# EAGLE design us_supply (EAGLE 4.11)
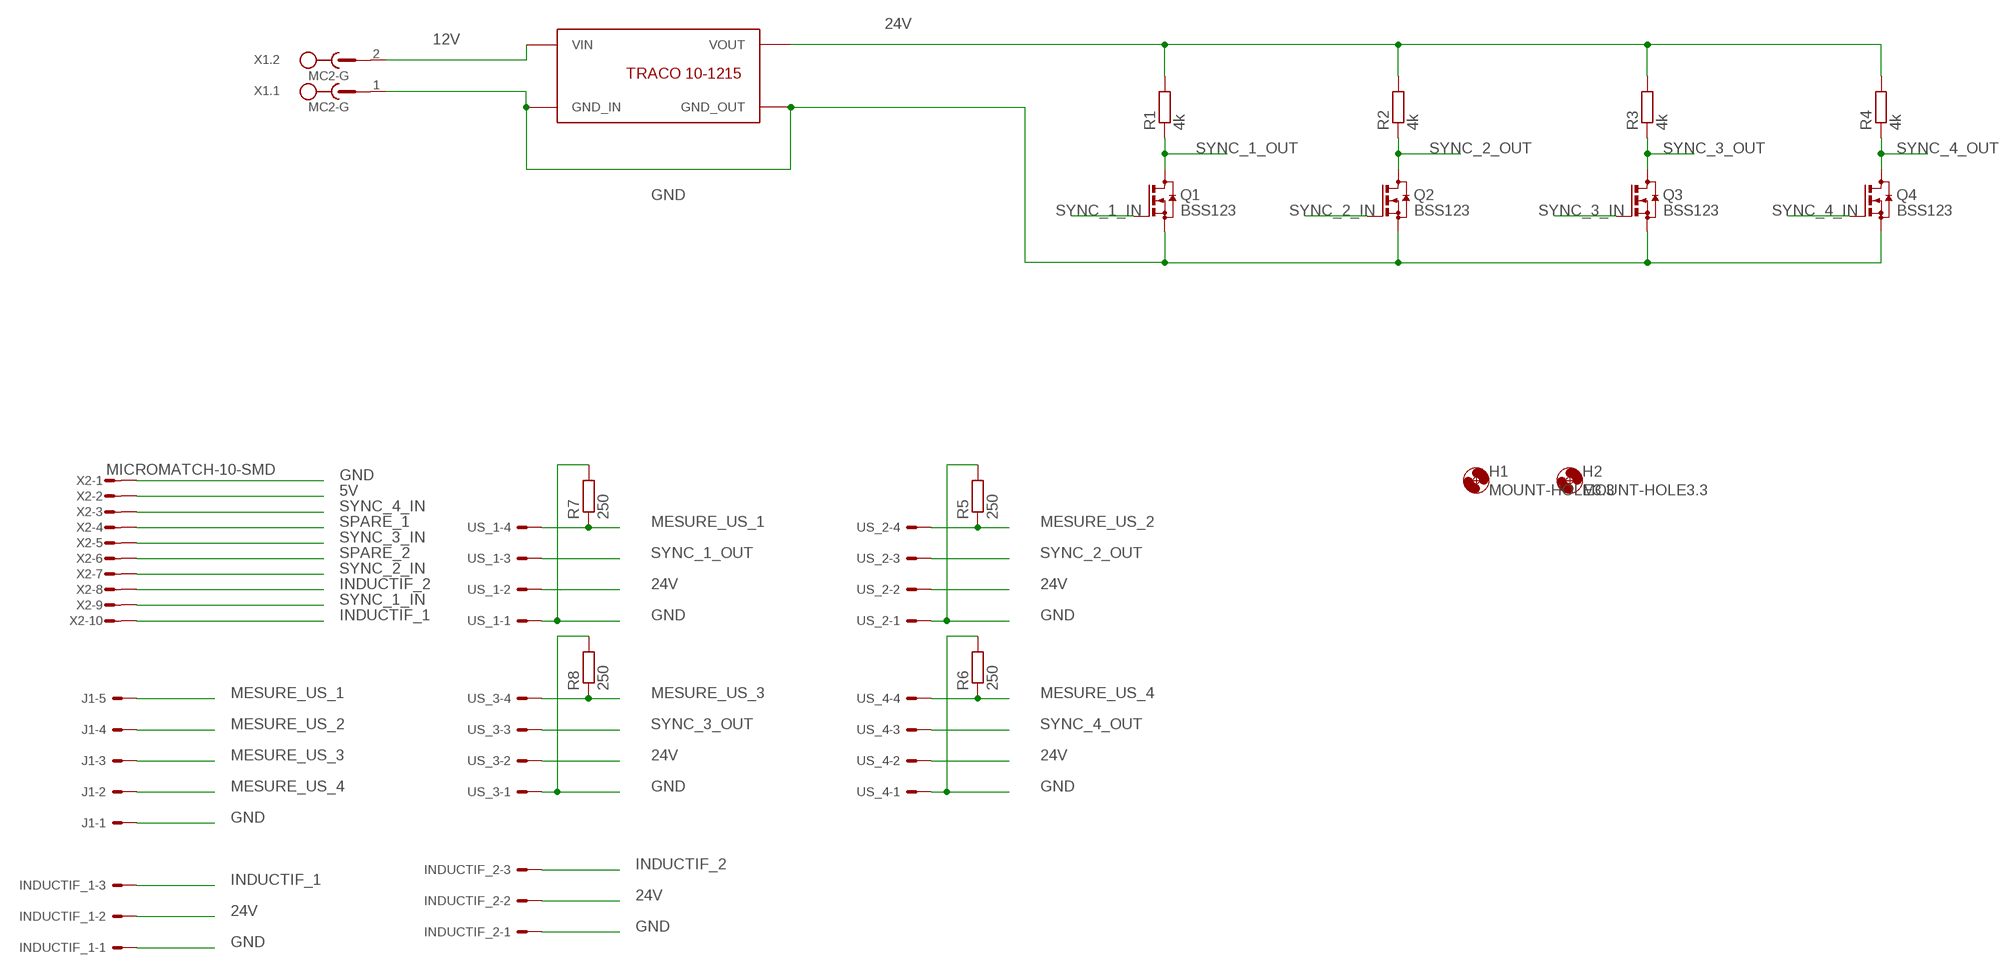
[diagram p0: schematic, sheet 1]

## Parts
H1  MOUNT-HOLE3.3  [3,3]
H2  MOUNT-HOLE3.3  [3,3]
INDUCTIF_1  ED1X03  [ED1X03]
INDUCTIF_2  ED1X03  [ED1X03]
J1  ED1X05  [ED1X05]
Q1  BSS123  [SOT23]
Q2  BSS123  [SOT23]
Q3  BSS123  [SOT23]
Q4  BSS123  [SOT23]
R1  4k  R-EU_R0805  [R0805]
R2  4k  R-EU_R0805  [R0805]
R3  4k  R-EU_R0805  [R0805]
R4  4k  R-EU_R0805  [R0805]
R5  250  R-EU_R0805  [R0805]
R6  250  R-EU_R0805  [R0805]
R7  250  R-EU_R0805  [R0805]
R8  250  R-EU_R0805  [R0805]
U$1  TRACO_TEN-10-1215  [TRACO_TEN-10-1215]
US_1  ED1X04  [ED1X04]
US_2  ED1X04  [ED1X04]
US_3  ED1X04  [ED1X04]
US_4  ED1X04  [ED1X04]
X1  MC2-G  [MC2-G]
X2  MICROMATCH-10-SMD  [MICROMATCH-10-SMD]

## Nets
5V: X2.2
12V: U$1.1(VIN) X1.2
24V: INDUCTIF_1.2 INDUCTIF_2.2 R1.2 R2.2 R3.2 R4.2 U$1.3(VOUT) US_1.2 US_2.2 US_3.2 US_4.2
GND: INDUCTIF_1.1 INDUCTIF_2.1 J1.1 Q1.2(S) Q2.2(S) Q3.2(S) Q4.2(S) R5.2 R6.2 R7.2 R8.2 U$1.2(GND_IN) U$1.5(GND_OUT) US_1.1 US_2.1 US_3.1 US_4.1 X1.1 X2.1
INDUCTIF_1: INDUCTIF_1.3 X2.10
INDUCTIF_2: INDUCTIF_2.3 X2.8
MESURE_US_1: J1.5 R7.1 US_1.4
MESURE_US_2: J1.4 R5.1 US_2.4
MESURE_US_3: J1.3 R8.1 US_3.4
MESURE_US_4: J1.2 R6.1 US_4.4
SPARE_1: X2.4
SPARE_2: X2.6
SYNC_1_IN: Q1.1(G) X2.9
SYNC_1_OUT: Q1.3(D) R1.1 US_1.3
SYNC_2_IN: Q2.1(G) X2.7
SYNC_2_OUT: Q2.3(D) R2.1 US_2.3
SYNC_3_IN: Q3.1(G) X2.5
SYNC_3_OUT: Q3.3(D) R3.1 US_3.3
SYNC_4_IN: Q4.1(G) X2.3
SYNC_4_OUT: Q4.3(D) R4.1 US_4.3

## Library data of the parts
H1 H2 = holes:MOUNT-HOLE: MOUNTING HOLE with drill center marker
INDUCTIF_1 INDUCTIF_2 = 2-apbteam_con-amp-he14:E?1X03: Male header simple row, 3 positions
J1 = 2-apbteam_con-amp-he14:E?1X05: Male header simple row, 5 positions
Q1-Q4 = transistor-small-signal:BSS123: N-CHANNEL MOS FET
R1-R8 = rcl:R-EU_: RESISTOR, European symbol
U$1 = 2-tracoboost:TRACO_TEN-10-1215
US_1-US_4 = 2-apbteam_con-amp-he14:E?1X04: Male header simple row, 4 positions
X1 = con-phoenix-381_l:MC2-G: Mini-Combicon 3.81mm horizontal 2-polig MC 1,5/2-G-3,81 Artikel-Nr. 1803277 mit Gegenstecker MC 1,5/2-ST-3,81 Artikel-Nr. 1803578
X2 = 2-apbteam_con-amp-micromatch:MICROMATCH-10: MicroMaTch 10

## Board
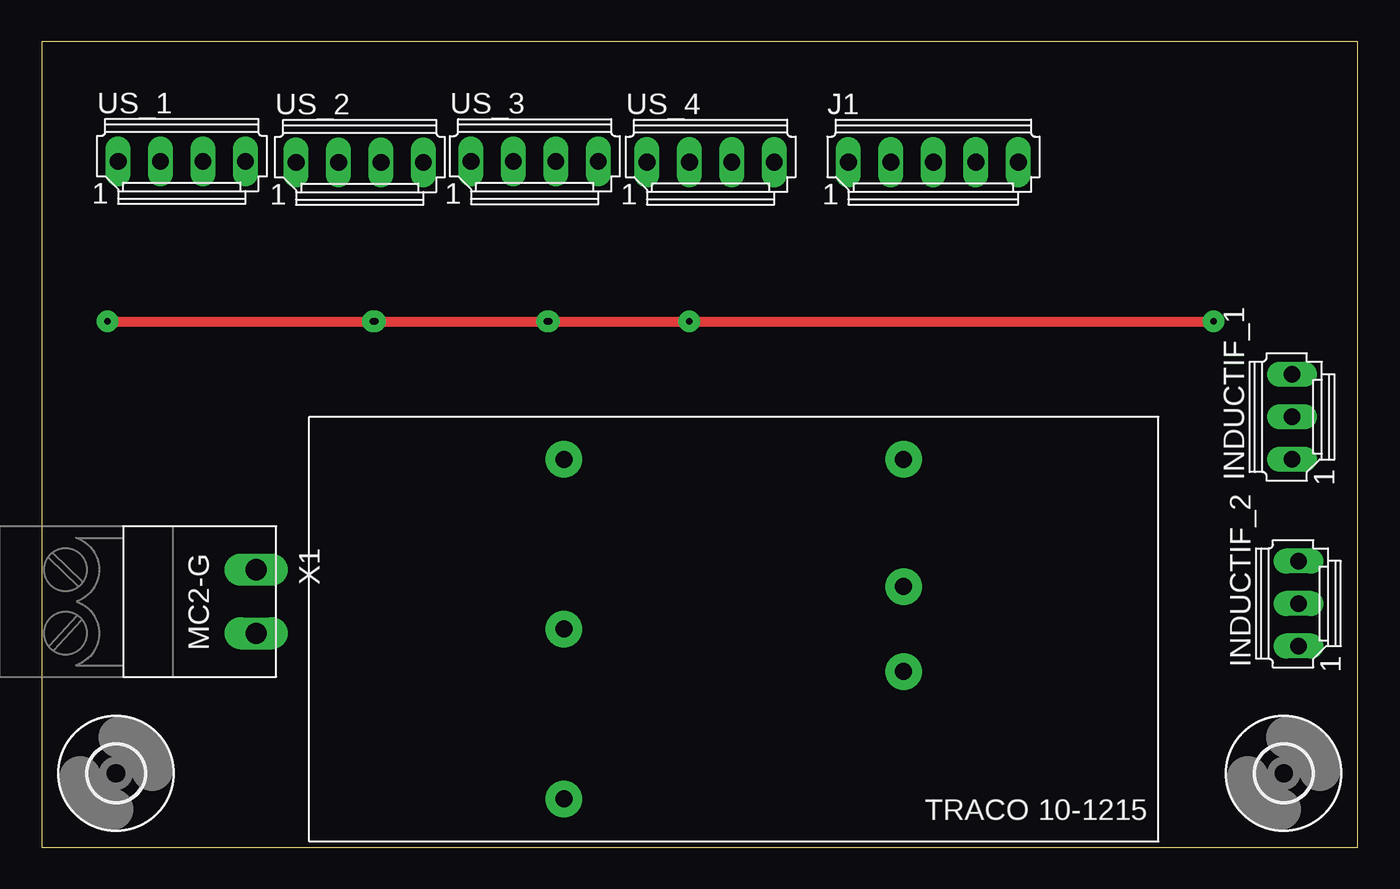
[diagram p1: board, top side]
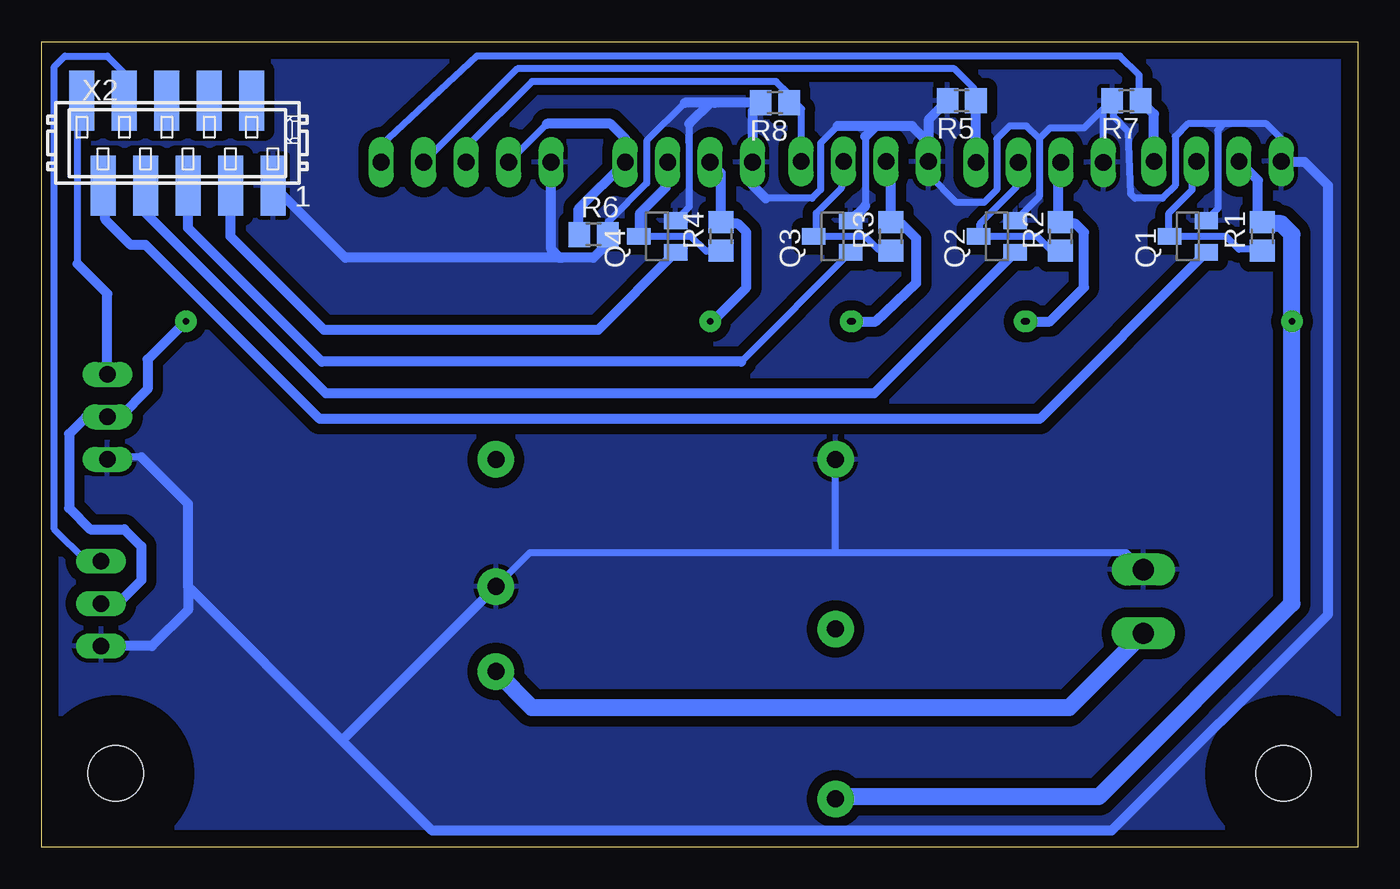
[diagram p2: board, bottom side, seen from below]

Size 78.72 x 48.18 mm. Coordinates in mm from the lower left corner, seen from the top.
Outline: 0,0 78.72,0 78.72,48.18 0,48.18 0,0
Copper layers (1*16): Top 0.035mm / dielectric 1.5mm / Bottom 0.035mm
Design rules "default": minimum track width 10mil, minimum drill 24mil, track to track 8mil, track to pad 8mil, pad to pad 8mil, via to via 8mil, smd to smd 8mil, copper to edge 40mil, drill to drill 8mil, minimum pad ring 10mil, minimum via ring 8mil, stop-mask expansion 4mil, vias tented up to drill 0mil, thermal gap 10mil

### Footprints (pad centres in the part's own frame; a part is rotated, then mirrored left to right if it is on the bottom)
3,3 = hole 3.3: 0,0
ED1X03 = drill 1 long: 1 -2.54,0; 2 0,0; 3 2.54,0
ED1X05 = drill 1 long: 1 -5.08,0; 2 -2.54,0; 3 0,0; 4 2.54,0; 5 5.08,0
SOT23 = smd 1 x 1.4: 1 -0.95,-1.1; 2 0.95,-1.1; 3 0,1.1
R0805 = smd 1.3 x 1.5: 1 -0.85,0; 2 0.85,0
TRACO_TEN-10-1215 = drill 1.016 pad 2.184 round: 1 10.16,-2.54; 2 10.16,2.54; 3 -10.16,-10.16; 4 -10.16,0; 5 -10.16,10.16; 6 10.16,10.16
ED1X04 = drill 1 long: 1 -3.81,0; 2 -1.27,0; 3 1.27,0; 4 3.81,0
MC2-G = drill 1.27 long: 1 -1.905,0; 2 1.905,0
MICROMATCH-10-SMD = smd 1.5 x 3.58: 1 5.715,-2.54; 2 4.445,2.54; 3 3.175,-2.54; 4 1.905,2.54; 5 0.635,-2.54; 6 -0.635,2.54; 7 -1.905,-2.54; 8 -3.175,2.54; 9 -4.445,-2.54; 10 -5.715,2.54

### Placement (x,y rotation side)
H1  74.29,4.41 0 top
H2  4.44,4.41 0 top
INDUCTIF_1  74.8,25.74 90 top
INDUCTIF_2  75.18,14.57 90 top
J1  53.34,40.98 0 top
Q1  10.15,36.54 90 bottom
Q2  21.59,36.54 90 bottom
Q3  31.43,36.54 90 bottom
Q4  41.9,36.54 90 bottom
R1  5.71,36.54 90 bottom
R2  17.78,36.54 90 bottom
R3  27.94,36.54 90 bottom
R4  38.09,36.54 90 bottom
R5  23.69,44.67 180 bottom
R6  45.71,36.65 0 bottom
R7  13.84,44.67 180 bottom
R8  34.86,44.54 180 bottom
U$1  41.4,13.04 0 top
US_1  8.38,41.03 0 top
US_2  19.02,40.97 0 top
US_3  29.48,41.02 0 top
US_4  40.01,40.98 0 top
X1  12.82,14.69 270 top
X2  70.61,42.13 0 bottom

### Tracks (layer width: path | path; a pad name or v marks a point on that pad's centre or on a via)
12V
  Bottom 1.016: X1.2 17.27,8.34 49.4,8.34 U$1.1
24V  (via drill 0.41 pad 1.27)
  Top 0.61: v3.93,31.46 v19.81,31.46 | v19.93,31.46 v30.22,31.46 | v30.35,31.46 v38.73,31.46 v70.1,31.46
  Bottom 0.406: 5.96,37.55 5.88,37.55 R1.2 5.8,37.3 5.84,37.3 | R3.2 27.94,37.3 27.94,37.17 | 27.94,40.74 US_3.2 | 17.9,37.3 17.86,37.3 R2.2 17.69,37.3 | 17.9,40.82 US_2.2 | v19.81,31.46 v19.93,31.46 | v30.22,31.46 v30.35,31.46 | 38.01,37.3 R4.2 | v38.73,31.46 38.6,31.46 | 74.04,25.74 INDUCTIF_1.2
  Bottom 0.61: US_1.2 5.96,39.89 5.96,37.55 | US_4.2 38.09,40.34 R4.2 | 17.9,37.3 17.9,40.82 | 17.69,37.3 16.89,37.3 16.38,36.79 16.38,33.49 18.41,31.46 v19.81,31.46 | v30.22,31.46 28.82,31.46 26.41,33.74 26.41,36.41 27.3,37.3 27.94,37.3 | 38.01,37.3 37.08,37.3 36.57,36.79 36.57,33.49 38.6,31.46 | v70.1,31.46 72.39,29.17 72.39,27.39 74.04,25.74 | INDUCTIF_1.2 76.07,25.74 77.08,24.73 77.08,20.28 75.81,19.01 73.78,19.01 72.77,18 72.77,15.96 74.04,14.69 75.31,14.69 INDUCTIF_2.2 | R3.2 27.94,40.74
  Bottom 1.016: U$1.3 31.11,3.01 15.49,3.01 3.93,14.57 v3.93,31.46 3.93,31.59 3.93,36.67 4.57,37.3 5.8,37.3
GND
  Bottom 0.406: US_2.1 15.11,40.87 | 8,43.27 5.46,43.27 4.57,42.38 US_1.1 4.57,40.98 | 8,43.27 8.38,42.89 8.38,38.19 9.05,37.51 Q1.2 | Q2.2 19.05,38.93 19.05,42.38 | 19.05,42.38 18.41,43.02 16.38,43.02 14.98,44.41 14.98,44.54 14.9,44.46 | 15.23,40.86 15.23,40.95 US_2.1 | 29.46,42.51 29.46,38.36 | 28.7,43.14 28.82,43.14 | 25.65,42.13 25.65,41.11 25.65,41 | Q4.2 40,38.29 40,42.13 | 40,42.13 40,42.63 | 19.05,42.38 19.81,43.14 20.82,43.14 21.59,42.38 21.59,39.33 22.35,38.57 24,38.57 25.65,40.22 25.65,41 | 25.65,41 US_3.1 | 35.68,44.89 R8.2 36.19,44.06 | 38.48,44.54 38.73,44.54 | 40,43.27 40,42.13 | 36.19,40.98 US_4.1 36.19,40.97 | 35.43,38.82 32.63,38.82 32.13,39.33 32.13,42.13 31.11,43.14 | 40.25,44.54 42.54,42.25 42.54,39.71 44.83,37.43 44.83,36.67 44.85,36.67 R6.2 | R6.2 44.95,36.57 | 47.62,35.27 47.75,35.27 | 44.95,36.67 44.88,36.67 R6.2 | INDUCTIF_1.1 74.67,23.33 72.77,23.33 | US_2.1 15.22,40.98 15.23,40.98 15.23,44.12 14.9,44.46 | 14.9,44.46 R7.2 14.6,44.67 14.6,43.69 13.71,42.8 13.58,39.08 13.33,38.82 11.68,38.82 10.92,39.59 10.92,42.51 10.15,43.27 8,43.27 | X1.1 13.84,17.61 31.36,17.61 | 31.36,17.61 49.52,17.61 U$1.2 | U$1.5 31.24,17.74 31.36,17.61
  Bottom 0.61: 29.46,38.36 Q3.2 | 28.82,43.14 29.46,42.51 | 25.65,42.13 26.67,43.14 28.7,43.14 31.11,43.14 | R5.2 25.65,43.55 25.65,41.11 | R8.2 38.48,44.54 40.25,44.54 | 38.73,44.54 40,43.27 | 36.19,40.98 36.19,44.06 | 36.19,40.97 36.19,39.59 35.43,38.82 | J1.1 48.25,35.78 47.75,35.27 | 44.95,36.67 44.95,36.03 45.71,35.27 47.62,35.27 60.57,35.27 X2.1 | 72.77,23.33 69.97,20.54 69.97,15.58 | 69.97,15.58 69.97,14.19 72.13,12.03 INDUCTIF_2.1 | 60.7,6.31 55.37,0.98 14.73,0.98 1.77,13.93 1.77,39.59 3.17,40.98 4.57,40.98 | 60.7,6.31 69.97,15.58 | U$1.2 60.7,6.44 60.7,6.31
  pour Bottom (isolate 0.61): -0.01,48.35 78.86,48.35 78.86,0.09 78.86,-0.04 78.86,-0.17 -0.13,-0.17 -0.13,48.35
INDUCTIF_1
  Bottom 0.406: X2.10 76.32,44.41 76.58,44.16 76.58,34.89 | INDUCTIF_1.3 74.8,28.16
  Bottom 0.61: 76.58,34.89 74.8,33.11 INDUCTIF_1.3
INDUCTIF_2
  Bottom 0.406: X2.8 73.78,46.32 74.8,47.33 77.34,47.33 77.97,46.7 77.97,19.01 76.07,17.11 INDUCTIF_2.3
MESURE_US_1
  Bottom 0.406: 12.19,40.98 US_1.4 | J1.5 58.41,42 52.7,47.33 14.22,47.33 13.08,46.19 13.08,44.67 R7.1
  Bottom 0.61: R7.1 12.19,43.87 US_1.4
MESURE_US_2
  Bottom 0.406: 22.98,40.82 US_2.4 22.86,40.99 | 22.86,44.65 R5.1 22.98,44.67 22.98,45.43 24.12,46.57 50.29,46.57 J1.4
  Bottom 0.61: 22.86,40.99 22.86,44.65
MESURE_US_3
  Bottom 0.406: 33.27,41 US_3.4 33.27,41.05 33.27,44.18 33.63,44.54 R8.1 | R8.1 34.16,44.54 | R8.1 34.03,44.56 34.03,45.05 34.79,45.81 49.4,45.81 53.34,41.87 J1.3
MESURE_US_4
  Bottom 0.406: 48.51,43.27 J1.2 | 43.81,40.98 US_4.4 | 46.6,36.67 46.58,36.67 R6.1
  Bottom 0.61: 48.51,43.27 44.7,43.27 43.81,42.38 43.81,40.98 46.6,38.19 46.6,36.67
SYNC_1_IN
  Bottom 0.406: 74.93,39.46 X2.9
  Bottom 0.61: Q1.1 19.03,25.62 62.1,25.62 72.51,36.03 73.4,36.03 74.93,37.55 74.93,39.46
SYNC_1_OUT
  Bottom 0.406: US_1.3 9.9,40.78 9.9,39.33 11.3,37.94 11.3,36.54 Q1.3 7.87,36.54 7.11,35.78 5.8,35.78 R1.1
SYNC_2_IN
  Bottom 0.406: 72.51,37.94 X2.7
  Bottom 0.61: Q2.1 28.93,27.14 61.72,27.14 72.51,37.94
SYNC_2_OUT
  Bottom 0.406: 22.6,36.54 19.17,36.54 18.41,35.78 17.78,35.78 R2.1 | 22.6,36.54 Q2.3 | US_2.3 20.44,40.82 20.44,39.46 22.6,37.3 22.6,36.54
SYNC_3_IN
  Bottom 0.406: Q3.1 36.88,29.04
  Bottom 0.61: 36.88,29.04 61.97,29.04 69.97,37.05 X2.5
SYNC_3_OUT
  Bottom 0.406: R3.1 28.02,35.78 28.7,35.78 29.46,36.54 32.38,36.54 | 32.38,36.54 Q3.3 | US_3.3 30.86,40.92 30.86,39.46 32.38,37.94 32.38,36.54
SYNC_4_IN
  Bottom 0.61: Q4.1 45.44,30.95 61.84,30.95 67.43,36.54 X2.3
SYNC_4_OUT
  Bottom 0.406: 41.4,40.87 US_4.3 | Q4.3 42.92,36.54 39.87,36.54 38.98,35.65 38.13,35.65 R4.1
  Bottom 0.61: 41.4,40.87 41.4,39.46 42.92,37.94 42.92,36.54